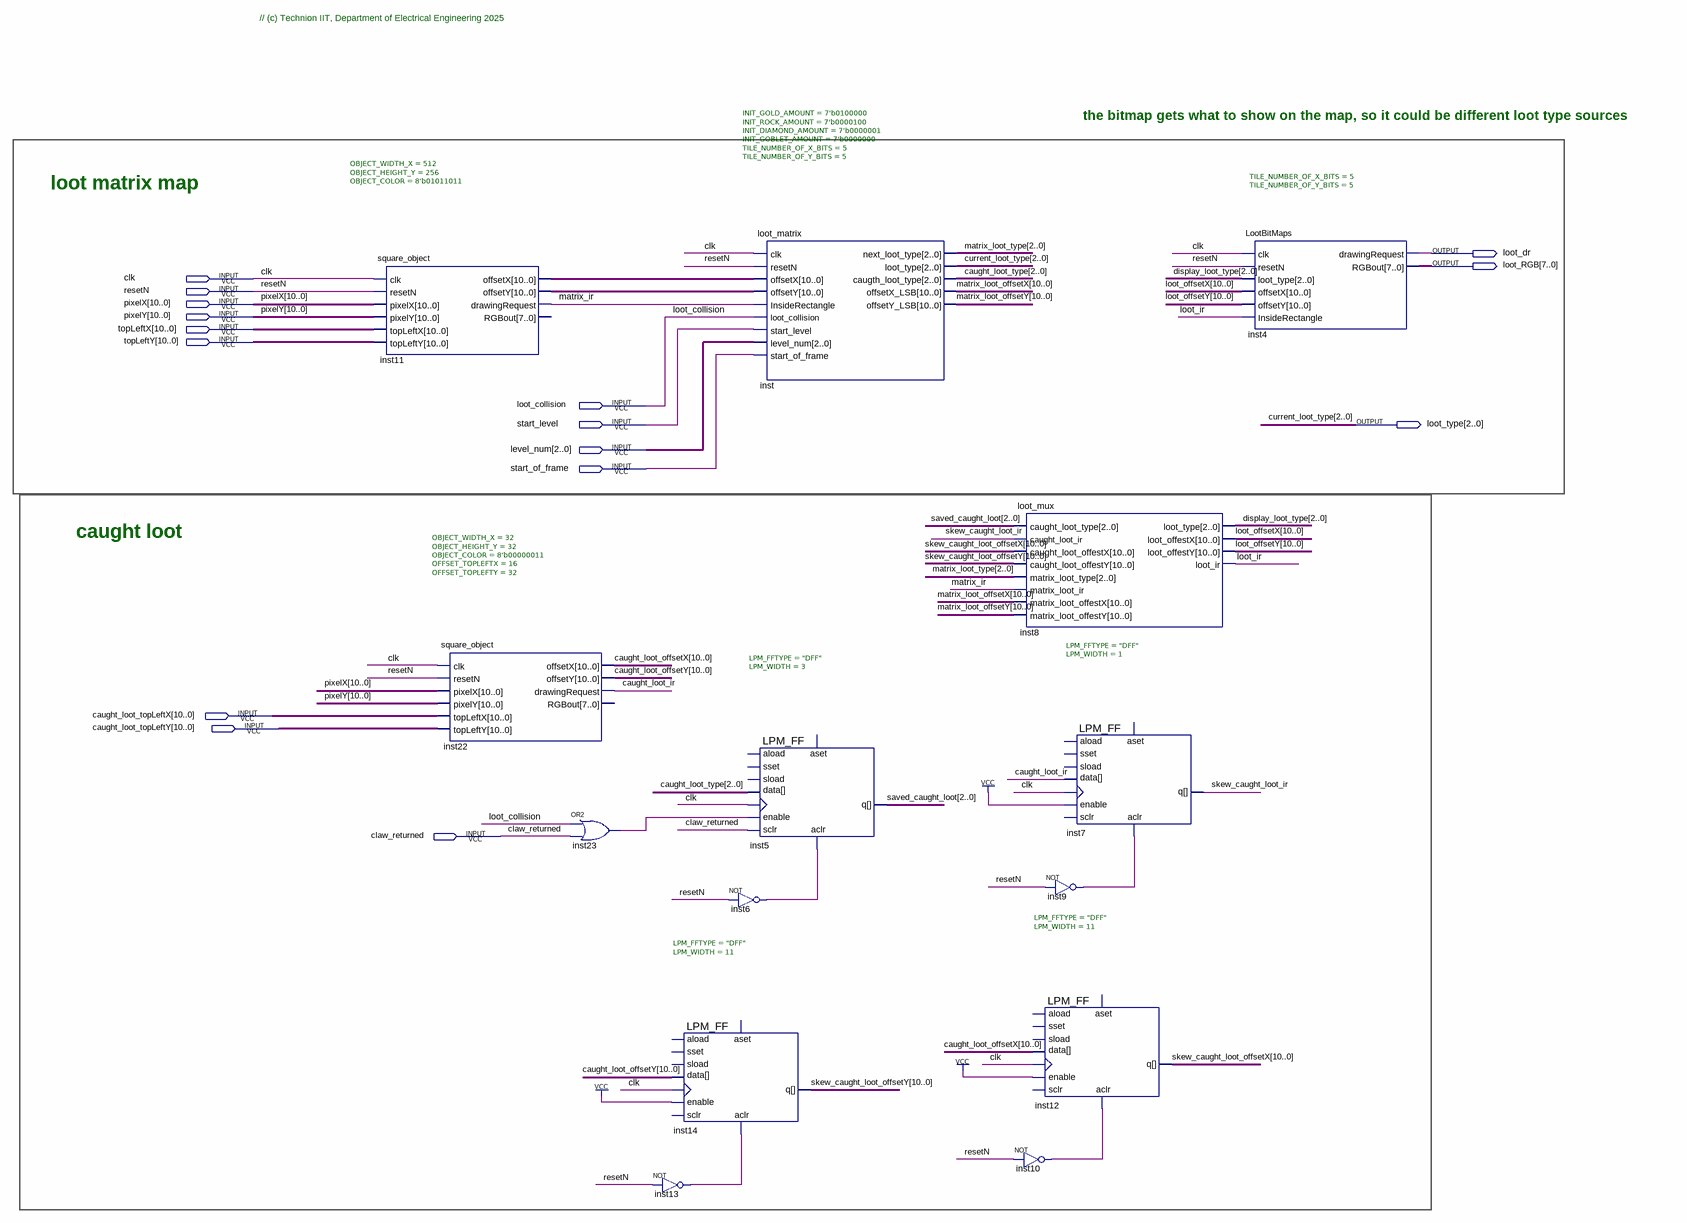
[diagram p0: schematic sheet]
// Quartus schematic loot_display_top.bdf as structural Verilog: 14 symbols, 16 pins
module loot_display_top (
  input  clk,
  input  resetN,
  input  [10:0] pixelX,
  input  [10:0] pixelY,
  input  [10:0] topLeftX,
  input  [10:0] topLeftY,
  input  loot_collision,
  input  start_level,
  input  [2:0] level_num,
  input  start_of_frame,
  input  [10:0] caught_loot_topLeftX,
  input  [10:0] caught_loot_topLeftY,
  input  claw_returned,
  output loot_dr,
  output [7:0] loot_RGB,
  output [2:0] loot_type
);

  wire caught_loot_ir, inst6_out, inst9_out, inst10_out, inst13_out, inst23_out, loot_ir, matrix_ir,
       skew_caught_loot_ir;
  wire [2:0] caught_loot_type, display_loot_type, matrix_loot_type, saved_caught_loot;
  wire [10:0] caught_loot_offsetX, caught_loot_offsetY, inst11_offsetx, inst11_offsety, loot_offsetX,
       loot_offsetY, matrix_loot_offsetX, matrix_loot_offsetY, skew_caught_loot_offsetX,
       skew_caught_loot_offsetY;

  square_object #(.OBJECT_WIDTH_X(512), .OBJECT_HEIGHT_Y(256), .OBJECT_COLOR(8'b01011011)) inst11 (
    .clk(clk), .resetN(resetN), .pixelX(pixelX), .pixelY(pixelY), .topLeftX(topLeftX), .topLeftY(topLeftY),
    .offsetX(inst11_offsetx), .offsetY(inst11_offsety), .drawingRequest(matrix_ir));  // open: RGBout
  square_object #(.OBJECT_WIDTH_X(32), .OBJECT_HEIGHT_Y(32), .OBJECT_COLOR(8'b00000011), .OFFSET_TOPLEFTX(16), .OFFSET_TOPLEFTY(32)) inst22 (
    .clk(clk), .resetN(resetN), .pixelX(pixelX), .pixelY(pixelY), .topLeftX(caught_loot_topLeftX),
    .topLeftY(caught_loot_topLeftY), .offsetX(caught_loot_offsetX), .offsetY(caught_loot_offsetY),
    .drawingRequest(caught_loot_ir));  // open: RGBout
  or inst23 (inst23_out, loot_collision, claw_returned);
  not inst13 (inst13_out, resetN);
  LPM_FF #(.LPM_FFTYPE("DFF"), .LPM_WIDTH(11)) inst14 (
    .enable(1'b1), .clock(clk), .aclr(inst13_out), .data(caught_loot_offsetY), .q(skew_caught_loot_offsetY));  // open: aload, sset, sload, aset, sclr
  loot_matrix #(.INIT_GOLD_AMOUNT(7'b0100000), .INIT_ROCK_AMOUNT(7'b0000100), .INIT_DIAMOND_AMOUNT(7'b0000001), .INIT_GOBLET_AMOUNT(7'b0000000), .TILE_NUMBER_OF_X_BITS(5), .TILE_NUMBER_OF_Y_BITS(5)) inst (
    .clk(clk), .resetN(resetN), .offsetX(inst11_offsetx), .offsetY(inst11_offsety),
    .InsideRectangle(matrix_ir), .loot_collision(loot_collision), .start_level(start_level),
    .level_num(level_num), .start_of_frame(start_of_frame), .next_loot_type(matrix_loot_type),
    .loot_type(loot_type), .caugth_loot_type(caught_loot_type), .offsetX_LSB(matrix_loot_offsetX),
    .offsetY_LSB(matrix_loot_offsetY));
  LPM_FF #(.LPM_FFTYPE("DFF"), .LPM_WIDTH(3)) inst5 (
    .enable(inst23_out), .clock(clk), .sclr(claw_returned), .aclr(inst6_out), .data(caught_loot_type),
    .q(saved_caught_loot));  // open: aload, sset, sload, aset
  not inst6 (inst6_out, resetN);
  loot_mux inst8 (
    .caught_loot_type(saved_caught_loot), .caught_loot_ir(skew_caught_loot_ir),
    .caught_loot_offestX(skew_caught_loot_offsetX), .caught_loot_offestY(skew_caught_loot_offsetY),
    .matrix_loot_type(matrix_loot_type), .matrix_loot_ir(matrix_ir),
    .matrix_loot_offestX(matrix_loot_offsetX), .matrix_loot_offestY(matrix_loot_offsetY),
    .loot_type(display_loot_type), .loot_offestX(loot_offsetX), .loot_offestY(loot_offsetY), .loot_ir(loot_ir));
  not inst10 (inst10_out, resetN);
  LPM_FF #(.LPM_FFTYPE("DFF"), .LPM_WIDTH(1)) inst7 (
    .enable(1'b1), .clock(clk), .aclr(inst9_out), .data(caught_loot_ir), .q(skew_caught_loot_ir));  // open: aload, sset, sload, aset, sclr
  not inst9 (inst9_out, resetN);
  LPM_FF #(.LPM_FFTYPE("DFF"), .LPM_WIDTH(11)) inst12 (
    .enable(1'b1), .clock(clk), .aclr(inst10_out), .data(caught_loot_offsetX), .q(skew_caught_loot_offsetX));  // open: aload, sset, sload, aset, sclr
  LootBitMaps #(.TILE_NUMBER_OF_X_BITS(5), .TILE_NUMBER_OF_Y_BITS(5)) inst4 (
    .clk(clk), .resetN(resetN), .loot_type(display_loot_type), .offsetX(loot_offsetX),
    .offsetY(loot_offsetY), .InsideRectangle(loot_ir), .drawingRequest(loot_dr), .RGBout(loot_RGB));

  // Other names for the same wires on the sheet: current_loot_type[2:0] = loot_type

  // Notes on the sheet:
  //   // (c) Technion IIT, Department of Electrical Engineering 2025
  //   the bitmap gets what to show on the map, so it could be different loot type sources
  //   loot matrix map 
  //   caught loot
endmodule
